# Altium schematic sheet originalSWEEP.SchDoc
size Tabloid; SheetNumber: 4; SheetTotal: 10
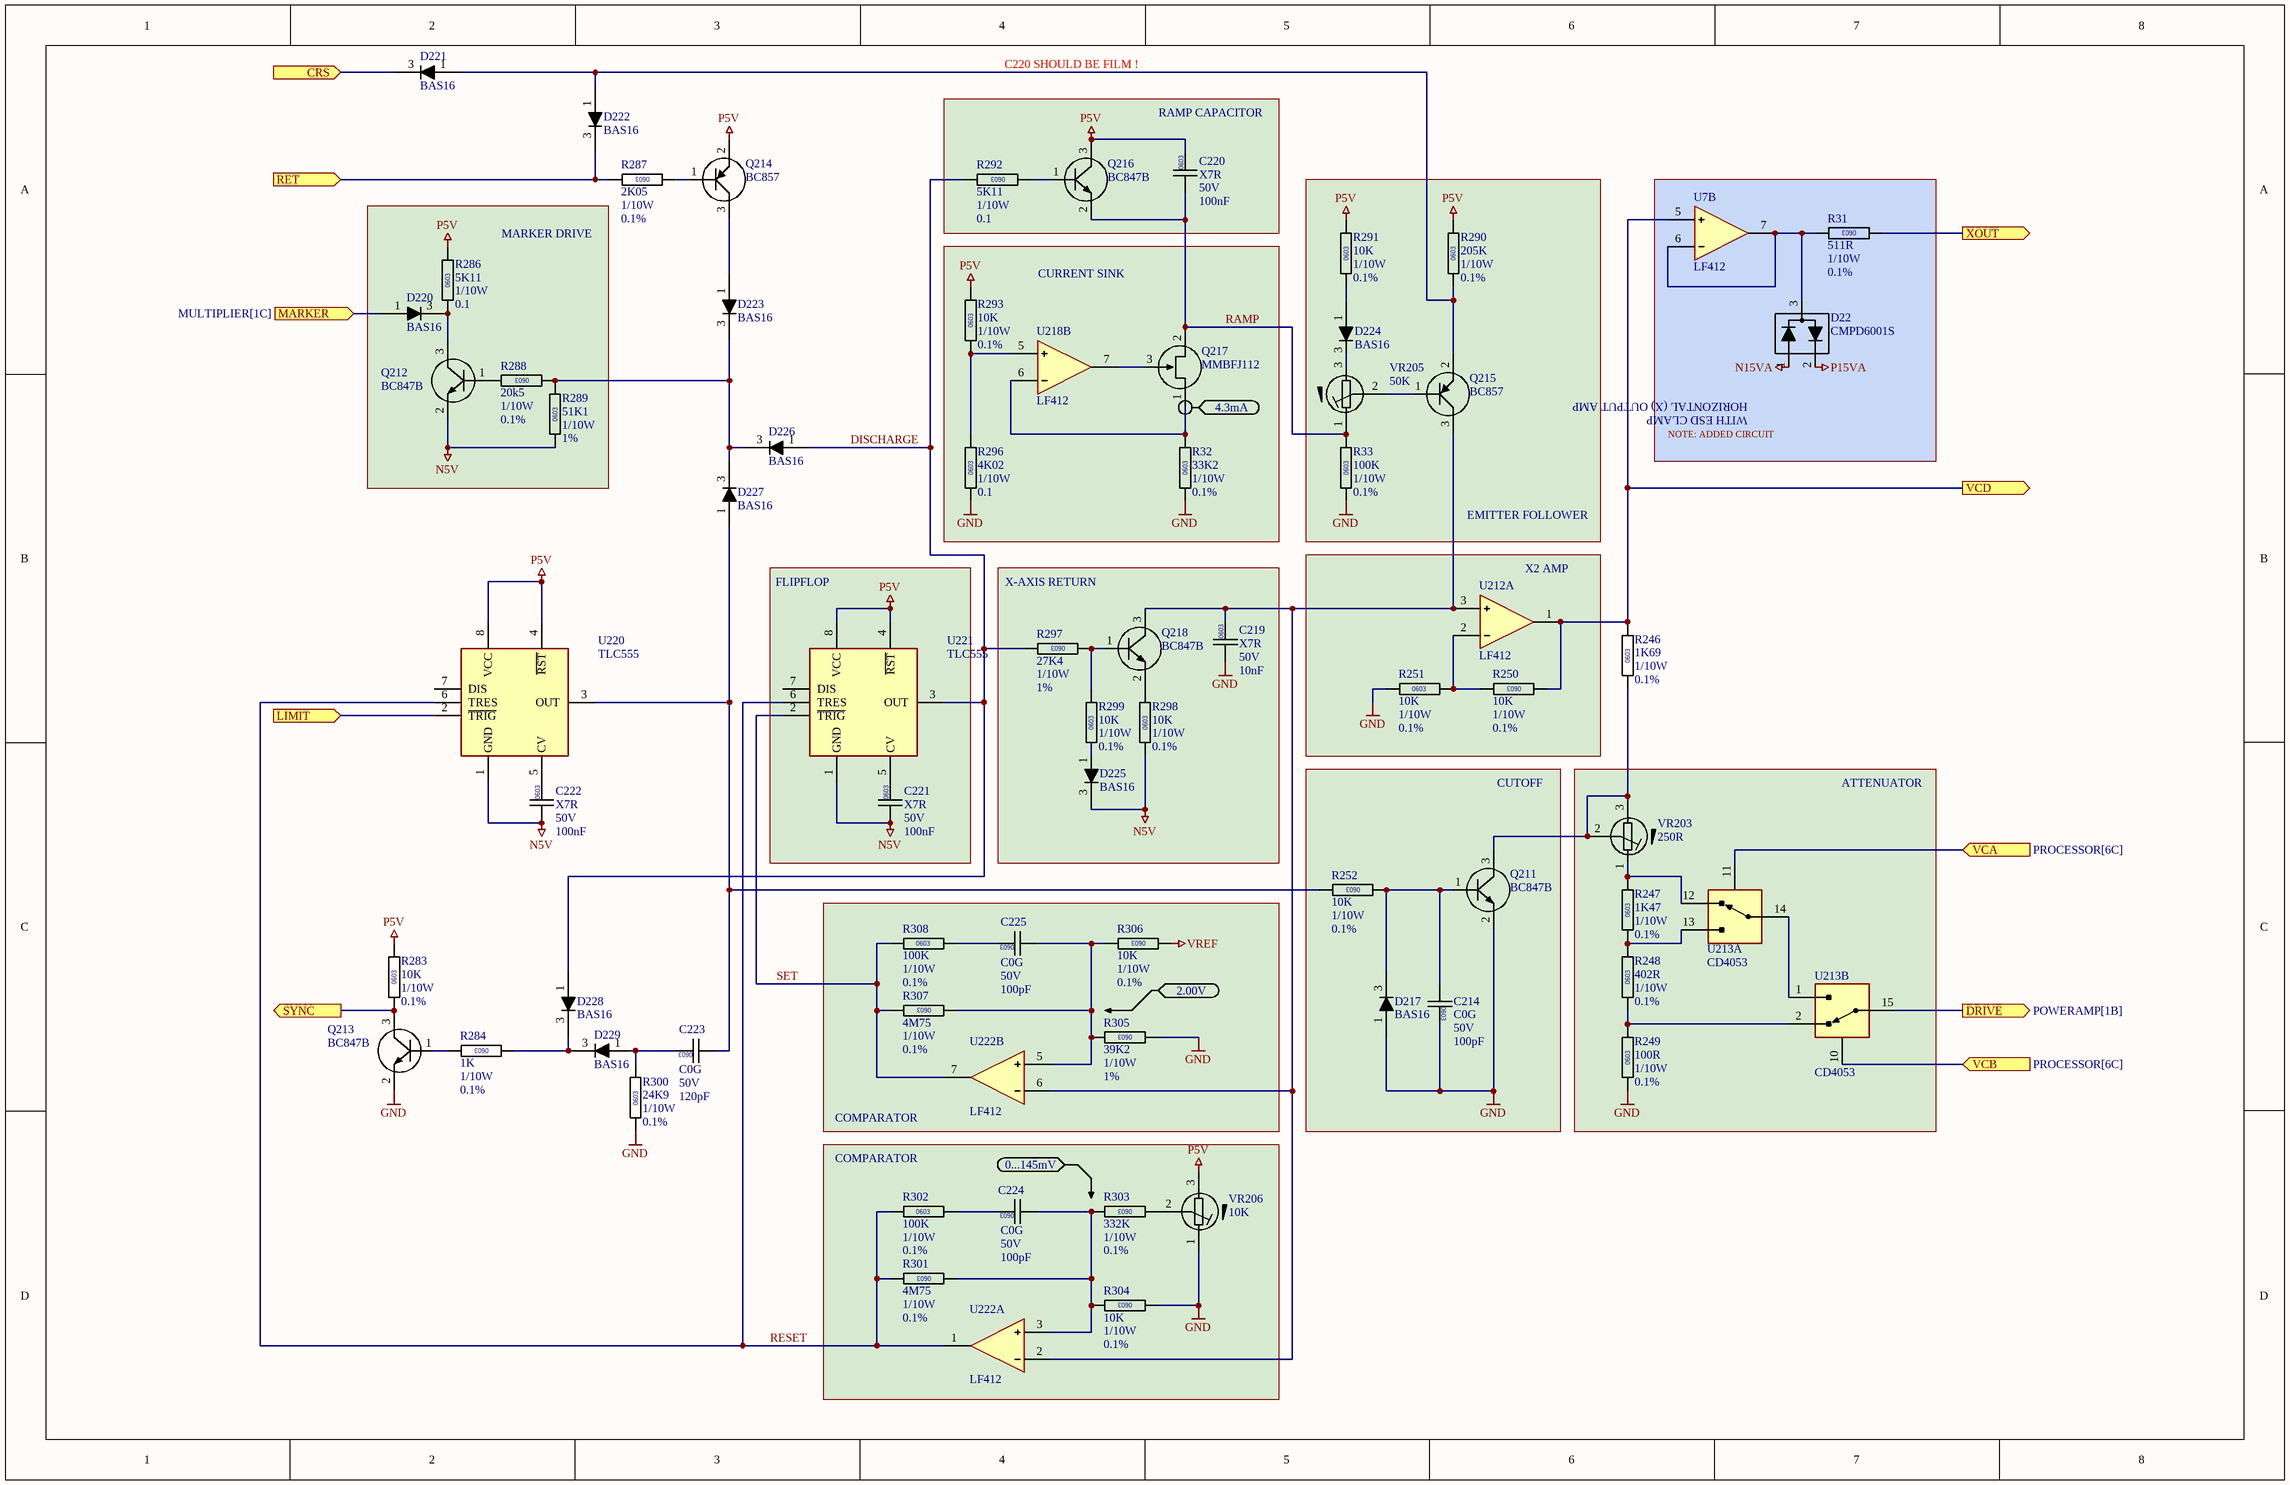
[diagram p0: originalSWEEP.SchDoc]

## Parts
C214  Dielectric: C0G  Voltage: 50V  Capacitance: 100pF  [CAPC0603]  (hidden comment: CAP0603)
C219  Dielectric: X7R  Voltage: 50V  Capacitance: 10nF  [CAPC0603]  (hidden comment: CAP0603)
C220  Dielectric: X7R  Voltage: 50V  Capacitance: 100nF  [CAPC0603]  (hidden comment: CAP0603)
C221  Dielectric: X7R  Voltage: 50V  Capacitance: 100nF  [CAPC0603]  (hidden comment: CAP0603)
C222  Dielectric: X7R  Voltage: 50V  Capacitance: 100nF  [CAPC0603]  (hidden comment: CAP0603)
C223  Dielectric: C0G  Voltage: 50V  Capacitance: 120pF  [CAPC0603]  (hidden comment: CAP0603)
C224  Dielectric: C0G  Voltage: 50V  Capacitance: 100pF  [CAPC0603]  (hidden comment: CAP0603)
C225  Dielectric: C0G  Voltage: 50V  Capacitance: 100pF  [CAPC0603]  (hidden comment: CAP0603)
D22  CMPD6001S  [SOT23]
D217  BAS16
D220  BAS16
D221  BAS16
D222  BAS16
D223  BAS16
D224  BAS16
D225  BAS16
D226  BAS16
D227  BAS16
D228  BAS16
D229  BAS16
Q211  BC847B  [SOT23]
Q212  BC847B  [SOT23]
Q213  BC847B  [SOT23]
Q214  BC857  [SOT23]
Q215  BC857  [SOT23]
Q216  BC847B  [SOT23]
Q217  MMBFJ112
Q218  BC847B  [SOT23]
R31  value 511R  Power: 1/10W  Tolerance: 0.1%  [RESC0603]  (hidden comment: RESC0603)
R32  value 33K2  Power: 1/10W  Tolerance: 0.1%  [RESC0603]  (hidden comment: RESC0603)
R33  value 100K  Power: 1/10W  Tolerance: 0.1%  [RESC0603]  (hidden comment: RESC0603)
R246  value 1K69  Power: 1/10W  Tolerance: 0.1%  [RESC0603]  (hidden comment: RESC0603)
R247  value 1K47  Power: 1/10W  Tolerance: 0.1%  [RESC0603]  (hidden comment: RESC0603)
R248  value 402R  Power: 1/10W  Tolerance: 0.1%  [RESC0603]  (hidden comment: RESC0603)
R249  value 100R  Power: 1/10W  Tolerance: 0.1%  [RESC0603]  (hidden comment: RESC0603)
R250  value 10K  Power: 1/10W  Tolerance: 0.1%  [RESC0603]  (hidden comment: RESC0603)
R251  value 10K  Power: 1/10W  Tolerance: 0.1%  [RESC0603]  (hidden comment: RESC0603)
R252  value 10K  Power: 1/10W  Tolerance: 0.1%  [RESC0603]  (hidden comment: RESC0603)
R283  value 10K  Power: 1/10W  Tolerance: 0.1%  [RESC0603]  (hidden comment: RESC0603)
R284  value 1K  Power: 1/10W  Tolerance: 0.1%  [RESC0603]  (hidden comment: RESC0603)
R286  value 5K11  Power: 1/10W  Tolerance: 0.1  [RESC0603]  (hidden comment: RESC0603)
R287  value 2K05  Power: 1/10W  Tolerance: 0.1%  [RESC0603]  (hidden comment: RESC0603)
R288  value 20k5  Power: 1/10W  Tolerance: 0.1%  [RESC0603]  (hidden comment: RESC0603)
R289  value 51K1  Power: 1/10W  Tolerance: 1%  [RESC0603]  (hidden comment: RESC0603)
R290  value 205K  Power: 1/10W  Tolerance: 0.1%  [RESC0603]  (hidden comment: RESC0603)
R291  value 10K  Power: 1/10W  Tolerance: 0.1%  [RESC0603]  (hidden comment: RESC0603)
R292  value 5K11  Power: 1/10W  Tolerance: 0.1  [RESC0603]  (hidden comment: RESC0603)
R293  value 10K  Power: 1/10W  Tolerance: 0.1%  [RESC0603]  (hidden comment: RESC0603)
R296  value 4K02  Power: 1/10W  Tolerance: 0.1  [RESC0603]  (hidden comment: RESC0603)
R297  value 27K4  Power: 1/10W  Tolerance: 1%  [RESC0603]  (hidden comment: RESC0603)
R298  value 10K  Power: 1/10W  Tolerance: 0.1%  [RESC0603]  (hidden comment: RESC0603)
R299  value 10K  Power: 1/10W  Tolerance: 0.1%  [RESC0603]  (hidden comment: RESC0603)
R300  value 24K9  Power: 1/10W  Tolerance: 0.1%  [RESC0603]  (hidden comment: RESC0603)
R301  value 4M75  Power: 1/10W  Tolerance: 0.1%  [RESC0603]  (hidden comment: RESC0603)
R302  value 100K  Power: 1/10W  Tolerance: 0.1%  [RESC0603]  (hidden comment: RESC0603)
R303  value 332K  Power: 1/10W  Tolerance: 0.1%  [RESC0603]  (hidden comment: RESC0603)
R304  value 10K  Power: 1/10W  Tolerance: 0.1%  [RESC0603]  (hidden comment: RESC0603)
R305  value 39K2  Power: 1/10W  Tolerance: 1%  [RESC0603]  (hidden comment: RESC0603)
R306  value 10K  Power: 1/10W  Tolerance: 0.1%  [RESC0603]  (hidden comment: RESC0603)
R307  value 4M75  Power: 1/10W  Tolerance: 0.1%  [RESC0603]  (hidden comment: RESC0603)
R308  value 100K  Power: 1/10W  Tolerance: 0.1%  [RESC0603]  (hidden comment: RESC0603)
U7  LF412  [SO127P600-8N]  (part B of 3)
U212  LF412  [SO127P600-8N]  (part A of 3)
U213  CD4053  [SO127P600-16N]  (parts A,B of 4)
U218  LF412  [SO127P600-8N]  (part B of 3)
U220  TLC555  [SO127P600-8N]
U221  TLC555  [SO127P600-8N]
U222  LF412  [SO127P600-8N]  (parts A,B of 3)
VR203  value 250R  [TRIMMER-BOURNS-3214X]  (hidden comment: TRIMMER-BOURNS-3214X-1-251)
VR205  value 50K  [TRIMMER-BOURNS-3214X]  (hidden comment: TRIMMER-BOURNS-3214X-1-503)
VR206  value 10K  [TRIMMER-BOURNS-3214X]  (hidden comment: TRIMMER-BOURNS-3214X-1-103E)

## Blocks framed on the sheet
RAMP CAPACITOR: C220 Q216 R292
MARKER DRIVE: D220 Q212 R286 R288 R289
EMITTER FOLLOWER: D224 Q215 R33 R290 R291 VR205
FLIPFLOP: C221 U221
X-AXIS RETURN: C219 D225 Q218 R297-R299
X2 AMP: R250 R251 U212
CUTOFF: C214 D217 Q211 R252
ATTENUATOR: R247-R249 U213 VR203

## Ports
CRS (in), DRIVE (out, see POWERAMP[1B]), LIMIT (in), MARKER (in, see MULTIPLIER[1C]), RET (in), SYNC (out), VCA (in, see PROCESSOR[6C]), VCB (in, see PROCESSOR[6C]), VCD (out), XOUT (out)

## Nets
GND: C214.1 C219.2 D217.1(A) Q211.2(E) Q213.2(E) R32.2 R33.2 R249.2 R251.2 R296.2 R300.2 R304.2 R305.2 VR206.1
N5V: C221.2 C222.2 D225.3(K) Q212.2(E) R289.2 R298.2 U220.1(GND) U221.1(GND)
N15VA: D22.1(K)
P5V: C220.1 Q214.2(E) Q216.3(C) R283.1 R286.1 R290.1 R291.1 R293.1 U220.4(~{RST}) U220.8(VCC) U221.4(~{RST}) U221.8(VCC) VR206.3
P15VA: D22.2(A)
VREF: R306.2
CRS: D221.3(K) ; port CRS
DISCHARGE: D226.1(A) D228.1(A) R292.2 R297.1 U221.3(OUT)
DRIVE: U213.15(X2) ; port DRIVE
LIMIT: U220.2(~{TRIG}) ; port LIMIT
MARKER: D220.1(A) ; port MARKER
RAMP: C220.2 Q216.2(E) Q217.2(S) R33.1 VR205.1
RESET: R301.1 R302.1 U220.6(TRES) U221.6(TRES) U222.1(O)
RET: D222.3(K) R287.1 ; port RET
SET: R307.1 R308.1 U221.2(~{TRIG}) U222.7(O)
SYNC: Q213.3(C) R283.2 ; port SYNC
VCA: U213.11(X3) ; port VCA
VCB: U213.10(A) ; port VCB
VCD: R246.1 R250.2 U7.5(+) U212.1(O) ; port VCD
XOUT: R31.2 ; port XOUT
NetC214_2: C214.2 D217.3(K) Q211.1(B) R252.2
NetC219_1: C219.1 Q215.3(C) Q218.3(C) U212.3(+) U222.2(-) U222.6(-)
NetC221_1: C221.1 U221.5(CV)
NetC222_1: C222.1 U220.5(CV)
NetC223_1: C223.1 D229.1(A) R300.1
NetC223_2: C223.2 D227.1(A) R252.1 U220.3(OUT)
NetC224_1: C224.1 R302.2
NetC224_2: C224.2 R301.2 R303.1 R304.1 U222.3(+)
NetC225_1: C225.1 R308.2
NetC225_2: C225.2 R305.1 R306.1 R307.2 U222.5(+)
NetD22_3: D22.3(A) R31.1 U7.6(-) U7.7(O)
NetD220_3: D220.3(K) Q212.3(C) R286.2
NetD221_1: D221.1(A) D222.1(A) Q215.2(E) R290.2
NetD223_1: D223.1(A) Q214.3(C)
NetD223_3: D223.3(K) D226.3(K) D227.3(K) R288.2 R289.1
NetD224_1: D224.1(A) R291.2
NetD224_3: D224.3(K) VR205.3
NetD225_1: D225.1(A) R299.2
NetD228_3: D228.3(K) D229.3(K) R284.2
NetQ211_3: Q211.3(C) R246.2 VR203.2 VR203.3
NetQ212_1: Q212.1(B) R288.1
NetQ213_1: Q213.1(B) R284.1
NetQ214_1: Q214.1(B) R287.2
NetQ215_1: Q215.1(B) VR205.2
NetQ216_1: Q216.1(B) R292.1
NetQ217_1: Q217.1(D) R32.1 U218.6(-)
NetQ217_3: Q217.3(G) U218.7(O)
NetQ218_1: Q218.1(B) R297.2 R299.1
NetQ218_2: Q218.2(E) R298.1
NetR247_1: R247.1 U213.12(X0) VR203.1
NetR247_2: R247.2 R248.1 U213.13(X)
NetR248_2: R248.2 R249.1 U213.2(Y2)
NetR250_1: R250.1 R251.1 U212.2(-)
NetR293_2: R293.2 R296.1 U218.5(+)
NetR303_2: R303.2 VR206.2
NetU213_1: U213.1(Y0) U213.14(X1)

Not connected (* = marked no-connect by the designer): U220 7(DIS); U221 7(DIS)

## Notes on the sheet
- C220 SHOULD BE FILM !
- CURRENT SINK
- 4.3mA
- NOTE: ADDED CIRCUIT
- (near D22) HORIZONTAL (X) OUTPUT AMP
- WITH ESD CLAMP
- 2.00V
- (near R302) COMPARATOR
- COMPARATOR
- 0...145mV
- (in symbol RESC-0603-1K47-0.1%-1/10W) 0603
- (in symbol RESC-0603-1K69-0.1%-1/10W) 0603
- (in symbol RESC-0603-1K-0.1%-1/10W) 0603
- (in symbol RESC-0603-2K05-0.1%-1/10W) 0603
- (in symbol RESC-0603-4K02-0.1%-1/10W) 0603
- (in symbol RESC-0603-4M75-1%-1/10W) 0603
- (in symbol RESC-0603-5K11-0.1%-1/10W) 0603
- (in symbol RESC-0603-10K-0.1%-1/10W) 0603
- (in symbol RESC-0603-20K5-0.1%-1/10W) 0603
- (in symbol RESC-0603-24K9-0.1%-1/10W) 0603
- (in symbol RESC-0603-27K4-1%-1/10W) 0603
- (in symbol RESC-0603-33K2-0.1%-1/10W) 0603
- (in symbol RESC-0603-39K2-0.1%-1/10W) 0603
- (in symbol RESC-0603-51K1-1%-1/10W) 0603
- (in symbol RESC-0603-100K-0.1%-1/10W) 0603
- (in symbol RESC-0603-100R,0.1%-1/10W) 0603
- (in symbol RESC-0603-205K-0.1%-1/10W) 0603
- (in symbol RESC-0603-332K-0.1%-1/10W) 0603
- (in symbol RESC-0603-402R-0.1%-1/10W) 0603
- (in symbol RESC-0603-511R-0.1%) 0603

## Library data of the parts
C214 C224 C225 = CAPC-0603-100pF-50V-C0G: CAPACITOR,CERAMIC,100pF,50V,C0G,0603; Package / Case: 0603; Location: *
C219 = CAPC-0603-10nF-50V-X7R: CAPACITOR,CERAMIC,10nF,50V,X7R,0603; Package / Case: 0603; Location: *
C220-C222 = CAPC-0603-100nF-50V-X7R: CAPACITOR,CERAMIC,100nF,50V,X7R,0603; Manufacturer 1: KEMET; Manufacturer Part Number 1: C0603C104K5RACTU; Package / Case: 0603; Location: *; Supplier 1: Mouser; Supplier Part Number 1: 80-C0603C104K5R7867; Supplier 2: Mouser; Supplier Part Number 2: 80-C0603C104K5R7411; Supplier 3: Avnet; Supplier Part Number 3: KGM15BR71H104KT; Supplier 4: Digikey; Supplier Part Number 4: 1276-1000-1-ND; LCSC: C127833; MOUSER: 80-C0603C104K5R
C223 = CAPC-0603-120pF-50V-C0G: CAPACITOR,CERAMIC,120pF,50V,C0G,0603; Package / Case: 0603; Location: *
D22 = DIODE-CENTRALSEMI-CMPD6001S: DIODE,75V,250mA,SOT23,500pA ULTRA LOW LEAKAGE; Manufacturer 1: CENTRAL SEMICONDUCTOR; Manufacturer Part Number 1: CMPD6001S
D217 D220-D229 = DIODE-RECTIFIER-DIODES-BAS16-SOT23: DIODE,RECTIFIER,75V,0.3A,BAS16,SOT23; Manufacturer 1: DIODES; Manufacturer Part Number 1: MMBD4148
Q211-Q213 Q216 Q218 = XSTR-NPN-BC847: XSTR,NPN,45V,0.1A,,BC847B,SOT23
Q214 Q215 = XSTR-PNP-BC857: XSTR,PNP,SOT23,BC857,SOT23
Q217 = XSTR-ONSEMI-J112-SOT23: XSTR,JFET,NCHAN,ONSEMI,MMBFJ112,SOT23; Manufacturer 1: ONSEMI; Manufacturer Part Number 1: MMBFJ112
R31 = RESC-0603-511R-0.1%: RESISTOR,511R,0.1%,100mW,0603 (1608); Location: *
R32 = RESC-0603-33K2-0.1%-1/10W: RESISTOR,33K2,0.1%,100mW,0603 (1608); Location: *
R33 R302 R308 = RESC-0603-100K-0.1%-1/10W: RESISTOR,100K,0.1%,100mW,0603 (1608); Location: *
R246 = RESC-0603-1K69-0.1%-1/10W: RESISTOR,1K69,0.1%,100mW,0603 (1608); Location: *
R247 = RESC-0603-1K47-0.1%-1/10W: RESISTOR,1K47,0.1%,100mW,0603 (1608); Location: *
R248 = RESC-0603-402R-0.1%-1/10W: RESISTOR,402R,0.1%,100mW,0603 (1608); Location: *
R249 = RESC-0603-100R,0.1%-1/10W: RESISTOR,100R,0.1%,100mW,0603 (1608); Location: *
R250-R252 R283 R291 R293 R298 R299 R304 R306 = RESC-0603-10K-0.1%-1/10W: RESISTOR,10K,0.1%,100mW,0603 (1608); Location: *
R284 = RESC-0603-1K-0.1%-1/10W: RESISTOR,1K,0.1%,100mW,0603 (1608); Location: *
R286 R292 = RESC-0603-5K11-0.1%-1/10W: RESISTOR,5K11,0.1%,100mW,0603 (1608); Location: *
R287 = RESC-0603-2K05-0.1%-1/10W: RESISTOR,2K05,0.11%,100mW,0603 (1608); Location: *
R288 = RESC-0603-20K5-0.1%-1/10W: RESISTOR,20K5,0.1%,100mW,0603 (1608); Location: *
R289 = RESC-0603-51K1-1%-1/10W: RESISTOR,51K1,1%,100mW,0603 (1608); Location: *
R290 = RESC-0603-205K-0.1%-1/10W: RESISTOR,205K,0.1%,100mW,0603 (1608); Location: *
R296 = RESC-0603-4K02-0.1%-1/10W: RESISTOR,4K02,0.1%,100mW,0603 (1608); Location: *
R297 = RESC-0603-27K4-1%-1/10W: RESISTOR,27K4,1%,100mW,0603 (1608); Location: *
R300 = RESC-0603-24K9-0.1%-1/10W: RESISTOR,24K9,0.1%,100mW,0603 (1608); Location: *
R301 R307 = RESC-0603-4M75-1%-1/10W: RESISTOR,4M75,0.1%,100mW,0603 (1608); Location: *
R303 = RESC-0603-332K-0.1%-1/10W: RESISTOR,332K,0.1%,100mW,0603 (1608); Location: *
R305 = RESC-0603-39K2-0.1%-1/10W: RESISTOR,39K2,0.1%,100mW,0603 (1608); Location: *
U7 U212 U218 U222 = IC-TI-LF412-S08: IC,OPAMP JFET,DUAL,LF412,SO8
U213 = IC-TI-CD4053-SPLIT: IC,MUX,TRIPLE 2:1 MUX,SPLIT BLOCKS
U220 U221 = IC-TI-TLC555-SO8: IC,TIMER,CMOSE,TI,TLC555,SO8
VR203 = TRIMMER-BOURNS-3214X-1-251: RESISTOR,MULTITURN,VERTICAL,5T,250R; Manufacturer 1: BOURNS; Manufacturer Part Number 1: 3214X-1-102E
VR205 = TRIMMER-BOURNS-3214X-1-503: RESISTOR,MULTITURN,VERTICAL,5T,50K; Manufacturer 1: BOURNS; Manufacturer Part Number 1: 3214X-1-102E
VR206 = TRIMMER-BOURNS-3214X-1-103E: RESISTOR,MULTITURN,VERTICAL,5T,10K; Manufacturer 1: BOURNS; Manufacturer Part Number 1: 3214X-1-102E